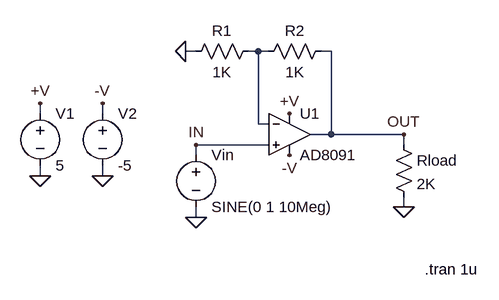
[diagram p0: schematic AD8091.asc]
AD8091.asc, the LTspice schematic file:
Version 4
SHEET 1 1240 700
WIRE 432 -1232 416 -1232
WIRE 528 -1232 512 -1232
WIRE 544 -1232 528 -1232
WIRE 640 -1232 624 -1232
WIRE 192 -1136 192 -1152
WIRE 288 -1136 288 -1152
WIRE 528 -1120 528 -1232
WIRE 544 -1120 528 -1120
WIRE 640 -1104 640 -1232
WIRE 640 -1104 608 -1104
WIRE 752 -1104 640 -1104
WIRE 544 -1088 432 -1088
WIRE 752 -1088 752 -1104
WIRE 432 -1072 432 -1088
WIRE 192 -1040 192 -1056
WIRE 288 -1040 288 -1056
WIRE 752 -992 752 -1008
WIRE 432 -976 432 -992
FLAG 432 -976 0
FLAG 752 -1104 OUT
FLAG 432 -1088 IN
FLAG 576 -1136 +V
FLAG 576 -1072 -V
FLAG 416 -1232 0
FLAG 752 -992 0
FLAG 192 -1152 +V
FLAG 192 -1040 0
FLAG 288 -1152 -V
FLAG 288 -1040 0
SYMBOL voltage 432 -1088 R0
WINDOW 123 24 146 Left 2
WINDOW 39 24 125 Left 2
SYMATTR InstName Vin
SYMATTR Value SINE(0 1 10Meg)
SYMBOL res 528 -1248 R90
WINDOW 0 0 56 VBottom 2
WINDOW 3 32 56 VTop 2
SYMATTR InstName R1
SYMATTR Value 1K
SYMBOL res 640 -1248 R90
WINDOW 0 0 56 VBottom 2
WINDOW 3 32 56 VTop 2
SYMATTR InstName R2
SYMATTR Value 1K
SYMBOL Opamps\\AD8091 576 -1168 R0
SYMATTR InstName U1
SYMBOL res 736 -1104 R0
SYMATTR InstName Rload
SYMATTR Value 2K
SYMBOL voltage 192 -1152 R0
WINDOW 123 0 0 Left 2
WINDOW 39 0 0 Left 2
SYMATTR InstName V1
SYMATTR Value 5
SYMBOL voltage 288 -1152 R0
WINDOW 123 24 146 Left 2
WINDOW 39 24 125 Left 2
SYMATTR InstName V2
SYMATTR Value -5
TEXT 784 -896 Left 2 !.tran 1u

The netlist it stands for:
* AD8091.asc
Vin IN 0 SINE(0 1 10Meg)
R1 N001 0 1K
R2 OUT N001 1K
XU1 IN N001 +V -V OUT AD8091  ; pins In+ In- V+ V- OUT
Rload OUT 0 2K
V1 +V 0 5
V2 -V 0 -5
.tran 1u
.backanno
.end